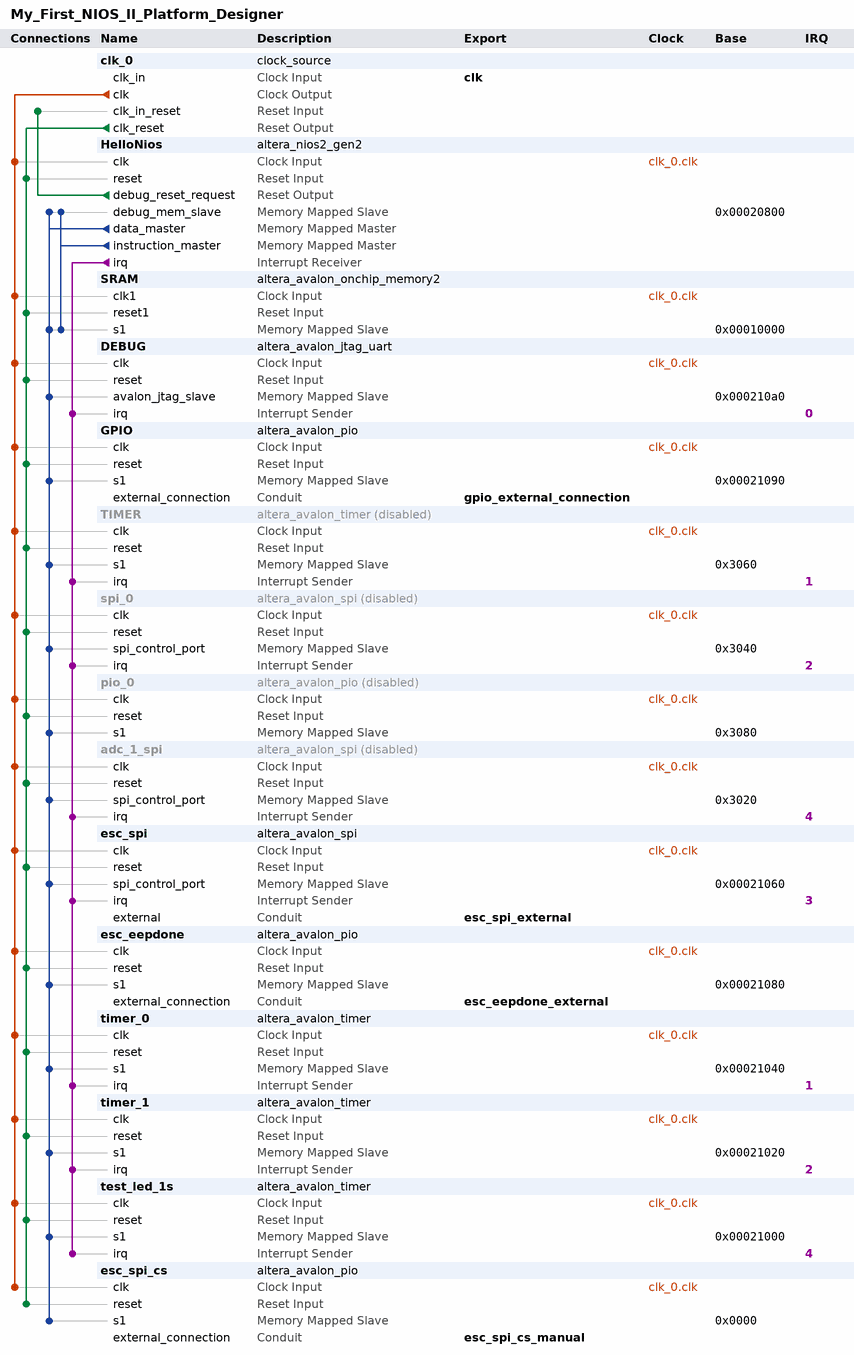
[diagram p0: system contents]
# Platform Designer (Qsys) system My_First_NIOS_II_Platform_Designer, Cyclone 10 LP 10CL025YU256I7G
# Parameters at their usual value, and those the tool derives, are not listed.
package require -exact qsys 18.1
create_system My_First_NIOS_II_Platform_Designer
set_project_property DEVICE_FAMILY {Cyclone 10 LP}
set_project_property DEVICE 10CL025YU256I7G

add_instance clk_0 clock_source 18.1
set_instance_parameter_value clk_0 clockFrequency 50000000

add_instance HelloNios altera_nios2_gen2 18.1
set_instance_parameter_value HelloNios dcache_size 2048
set_instance_parameter_value HelloNios exceptionSlave SRAM.s1
set_instance_parameter_value HelloNios icache_size 4096
set_instance_parameter_value HelloNios impl Tiny
set_instance_parameter_value HelloNios resetSlave SRAM.s1

add_instance SRAM altera_avalon_onchip_memory2 18.1
set_instance_parameter_value SRAM dataWidth 32
set_instance_parameter_value SRAM dualPort false
set_instance_parameter_value SRAM initMemContent true
set_instance_parameter_value SRAM initializationFileName C:/Users/guan-ming.dennis-won/Documents/Code/Workspace/Workspace/Cyclone_10_LP/NIOS_II/software/HelloNios_II/mem_init/My_First_NIOS_II_Platform_Designer_SRAM.hex
set_instance_parameter_value SRAM memorySize 40960
set_instance_parameter_value SRAM useNonDefaultInitFile true

add_instance DEBUG altera_avalon_jtag_uart 18.1
set_instance_parameter_value DEBUG simInteractiveOptions NO_INTERACTIVE_WINDOWS

add_instance GPIO altera_avalon_pio 18.1
set_instance_parameter_value GPIO direction Output
set_instance_parameter_value GPIO width 8

add_instance TIMER altera_avalon_timer 18.1
set_instance_property TIMER ENABLED false
set_instance_parameter_value TIMER period 0.5
set_instance_parameter_value TIMER periodUnits SEC

add_instance spi_0 altera_avalon_spi 18.1
set_instance_property spi_0 ENABLED false
set_instance_parameter_value spi_0 clockPhase 1
set_instance_parameter_value spi_0 clockPolarity 0
set_instance_parameter_value spi_0 dataWidth 8
set_instance_parameter_value spi_0 masterSPI true
set_instance_parameter_value spi_0 numberOfSlaves 1
set_instance_parameter_value spi_0 targetClockRate 3125000

add_instance pio_0 altera_avalon_pio 18.1
set_instance_property pio_0 ENABLED false
set_instance_parameter_value pio_0 direction Output
set_instance_parameter_value pio_0 width 8

add_instance adc_1_spi altera_avalon_spi 18.1
set_instance_property adc_1_spi ENABLED false
set_instance_parameter_value adc_1_spi clockPhase 1
set_instance_parameter_value adc_1_spi clockPolarity 0
set_instance_parameter_value adc_1_spi dataWidth 8
set_instance_parameter_value adc_1_spi masterSPI true
set_instance_parameter_value adc_1_spi numberOfSlaves 1
set_instance_parameter_value adc_1_spi targetClockRate 3125000

add_instance esc_spi altera_avalon_spi 18.1
set_instance_parameter_value esc_spi clockPhase 1
set_instance_parameter_value esc_spi clockPolarity 1
set_instance_parameter_value esc_spi dataWidth 8
set_instance_parameter_value esc_spi masterSPI true
set_instance_parameter_value esc_spi numberOfSlaves 1
set_instance_parameter_value esc_spi targetClockRate 25000000

add_instance esc_eepdone altera_avalon_pio 18.1
set_instance_parameter_value esc_eepdone direction Input
set_instance_parameter_value esc_eepdone width 1

add_instance timer_0 altera_avalon_timer 18.1
set_instance_parameter_value timer_0 period 1
set_instance_parameter_value timer_0 periodUnits MSEC

add_instance timer_1 altera_avalon_timer 18.1
set_instance_parameter_value timer_1 period 2
set_instance_parameter_value timer_1 periodUnits MSEC

add_instance test_led_1s altera_avalon_timer 18.1
set_instance_parameter_value test_led_1s period 1
set_instance_parameter_value test_led_1s periodUnits SEC

add_instance esc_spi_cs altera_avalon_pio 18.1
set_instance_parameter_value esc_spi_cs direction Output
set_instance_parameter_value esc_spi_cs resetValue 1
set_instance_parameter_value esc_spi_cs width 1

# connections
add_connection clk_0.clk adc_1_spi.clk clock
add_connection clk_0.clk DEBUG.clk clock
add_connection clk_0.clk esc_eepdone.clk clock
add_connection clk_0.clk esc_spi.clk clock
add_connection clk_0.clk esc_spi_cs.clk clock
add_connection clk_0.clk GPIO.clk clock
add_connection clk_0.clk HelloNios.clk clock
add_connection clk_0.clk pio_0.clk clock
add_connection clk_0.clk spi_0.clk clock
add_connection clk_0.clk SRAM.clk1 clock
add_connection clk_0.clk test_led_1s.clk clock
add_connection clk_0.clk TIMER.clk clock
add_connection clk_0.clk timer_0.clk clock
add_connection clk_0.clk timer_1.clk clock
add_connection clk_0.clk_reset adc_1_spi.reset reset
add_connection clk_0.clk_reset DEBUG.reset reset
add_connection clk_0.clk_reset esc_eepdone.reset reset
add_connection clk_0.clk_reset esc_spi.reset reset
add_connection clk_0.clk_reset esc_spi_cs.reset reset
add_connection clk_0.clk_reset GPIO.reset reset
add_connection clk_0.clk_reset HelloNios.reset reset
add_connection clk_0.clk_reset pio_0.reset reset
add_connection clk_0.clk_reset spi_0.reset reset
add_connection clk_0.clk_reset SRAM.reset1 reset
add_connection clk_0.clk_reset test_led_1s.reset reset
add_connection clk_0.clk_reset TIMER.reset reset
add_connection clk_0.clk_reset timer_0.reset reset
add_connection clk_0.clk_reset timer_1.reset reset
add_connection HelloNios.debug_reset_request clk_0.clk_in_reset reset
add_connection HelloNios.data_master adc_1_spi.spi_control_port avalon
set_connection_parameter_value HelloNios.data_master/adc_1_spi.spi_control_port baseAddress 0x3020
add_connection HelloNios.data_master DEBUG.avalon_jtag_slave avalon
set_connection_parameter_value HelloNios.data_master/DEBUG.avalon_jtag_slave baseAddress 0x000210a0
add_connection HelloNios.data_master esc_eepdone.s1 avalon
set_connection_parameter_value HelloNios.data_master/esc_eepdone.s1 baseAddress 0x00021080
add_connection HelloNios.data_master esc_spi.spi_control_port avalon
set_connection_parameter_value HelloNios.data_master/esc_spi.spi_control_port baseAddress 0x00021060
add_connection HelloNios.data_master esc_spi_cs.s1 avalon
set_connection_parameter_value HelloNios.data_master/esc_spi_cs.s1 baseAddress 0x0000
add_connection HelloNios.data_master GPIO.s1 avalon
set_connection_parameter_value HelloNios.data_master/GPIO.s1 baseAddress 0x00021090
add_connection HelloNios.data_master HelloNios.debug_mem_slave avalon
set_connection_parameter_value HelloNios.data_master/HelloNios.debug_mem_slave baseAddress 0x00020800
add_connection HelloNios.data_master pio_0.s1 avalon
set_connection_parameter_value HelloNios.data_master/pio_0.s1 baseAddress 0x3080
add_connection HelloNios.data_master spi_0.spi_control_port avalon
set_connection_parameter_value HelloNios.data_master/spi_0.spi_control_port baseAddress 0x3040
add_connection HelloNios.data_master SRAM.s1 avalon
set_connection_parameter_value HelloNios.data_master/SRAM.s1 baseAddress 0x00010000
add_connection HelloNios.data_master test_led_1s.s1 avalon
set_connection_parameter_value HelloNios.data_master/test_led_1s.s1 baseAddress 0x00021000
add_connection HelloNios.data_master TIMER.s1 avalon
set_connection_parameter_value HelloNios.data_master/TIMER.s1 baseAddress 0x3060
add_connection HelloNios.data_master timer_0.s1 avalon
set_connection_parameter_value HelloNios.data_master/timer_0.s1 baseAddress 0x00021040
add_connection HelloNios.data_master timer_1.s1 avalon
set_connection_parameter_value HelloNios.data_master/timer_1.s1 baseAddress 0x00021020
add_connection HelloNios.instruction_master HelloNios.debug_mem_slave avalon
set_connection_parameter_value HelloNios.instruction_master/HelloNios.debug_mem_slave baseAddress 0x00020800
add_connection HelloNios.instruction_master SRAM.s1 avalon
set_connection_parameter_value HelloNios.instruction_master/SRAM.s1 baseAddress 0x00010000
add_connection HelloNios.irq adc_1_spi.irq interrupt
set_connection_parameter_value HelloNios.irq/adc_1_spi.irq irqNumber 4
add_connection HelloNios.irq DEBUG.irq interrupt
set_connection_parameter_value HelloNios.irq/DEBUG.irq irqNumber 0
add_connection HelloNios.irq esc_spi.irq interrupt
set_connection_parameter_value HelloNios.irq/esc_spi.irq irqNumber 3
add_connection HelloNios.irq spi_0.irq interrupt
set_connection_parameter_value HelloNios.irq/spi_0.irq irqNumber 2
add_connection HelloNios.irq test_led_1s.irq interrupt
set_connection_parameter_value HelloNios.irq/test_led_1s.irq irqNumber 4
add_connection HelloNios.irq TIMER.irq interrupt
set_connection_parameter_value HelloNios.irq/TIMER.irq irqNumber 1
add_connection HelloNios.irq timer_0.irq interrupt
set_connection_parameter_value HelloNios.irq/timer_0.irq irqNumber 1
add_connection HelloNios.irq timer_1.irq interrupt
set_connection_parameter_value HelloNios.irq/timer_1.irq irqNumber 2

# exported interfaces
add_interface clk clock sink
set_interface_property clk EXPORT_OF clk_0.clk_in
add_interface esc_eepdone_external conduit end
set_interface_property esc_eepdone_external EXPORT_OF esc_eepdone.external_connection
add_interface esc_spi_cs_manual conduit end
set_interface_property esc_spi_cs_manual EXPORT_OF esc_spi_cs.external_connection
add_interface esc_spi_external conduit end
set_interface_property esc_spi_external EXPORT_OF esc_spi.external
add_interface gpio_external_connection conduit end
set_interface_property gpio_external_connection EXPORT_OF GPIO.external_connection

set_interconnect_requirement {$system} qsys_mm.clockCrossingAdapter HANDSHAKE
set_interconnect_requirement {$system} qsys_mm.enableEccProtection FALSE
set_interconnect_requirement {$system} qsys_mm.insertDefaultSlave FALSE
set_interconnect_requirement {$system} qsys_mm.maxAdditionalLatency 1

save_system My_First_NIOS_II_Platform_Designer.qsys
